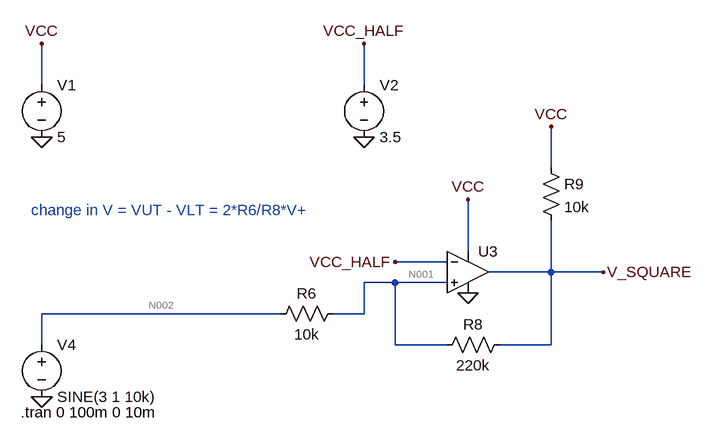
[diagram p0: schematic ovp.asc]
ovp.asc, the LTspice schematic file:
Version 4.1
SHEET 1 4088 1428
WIRE -592 -224 -592 -288
WIRE -96 -224 -96 -288
WIRE 192 -96 192 -160
WIRE 64 32 64 -48
WIRE 32 48 -48 48
WIRE 192 64 192 -16
WIRE 192 64 96 64
WIRE 272 64 192 64
WIRE -48 80 -96 80
WIRE 32 80 -48 80
WIRE -224 128 -592 128
WIRE -96 128 -96 80
WIRE -96 128 -144 128
WIRE -592 176 -592 128
WIRE -48 176 -48 80
WIRE 32 176 -48 176
WIRE 192 176 192 64
WIRE 192 176 112 176
FLAG -592 -144 0
FLAG 272 64 V_SQUARE
FLAG 64 96 0
FLAG 64 -48 VCC
FLAG 192 -160 VCC
FLAG -48 48 VCC_HALF
FLAG -96 -144 0
FLAG -592 -288 VCC
FLAG -96 -288 VCC_HALF
FLAG -592 256 0
SYMBOL voltage -592 -240 R0
WINDOW 123 0 0 Left 0
WINDOW 39 0 0 Left 0
SYMATTR InstName V1
SYMATTR Value 5
SYMBOL OpAmps\\UniversalOpAmp2 64 64 R0
SYMATTR InstName U3
SYMBOL res 128 160 R90
WINDOW 0 0 56 VBottom 2
WINDOW 3 32 56 VTop 2
SYMATTR InstName R8
SYMATTR Value 220k
SYMBOL res 176 -112 R0
SYMATTR InstName R9
SYMATTR Value 10k
SYMBOL res -128 112 R90
WINDOW 0 0 56 VBottom 2
WINDOW 3 32 56 VTop 2
SYMATTR InstName R6
SYMATTR Value 10k
SYMBOL voltage -96 -240 R0
WINDOW 123 0 0 Left 0
WINDOW 39 0 0 Left 0
SYMATTR InstName V2
SYMATTR Value 3.5
SYMBOL voltage -592 160 R0
WINDOW 123 0 0 Left 0
WINDOW 39 0 0 Left 0
SYMATTR InstName V4
SYMATTR Value SINE(3 1 10k)
TEXT -624 280 Left 2 !.tran 0 100m 0 10m
TEXT -608 -32 Left 2 ;change in V = VUT - VLT = 2*R6/R8*V+

The netlist it stands for:
* ovp.asc
V1 VCC 0 5
X§U3 N001 VCC_HALF VCC 0 V_SQUARE level2 Avol=1Meg GBW=10Meg Slew=10Meg Ilimit=25m Rail=0 Vos=0 En=0 Enk=0 In=0 Ink=0 Rin=500Meg  ; pins In+ In- V+ V- OUT
R8 V_SQUARE N001 220k
R9 VCC V_SQUARE 10k
R6 N001 N002 10k
V2 VCC_HALF 0 3.5
V4 N002 0 SINE(3 1 10k)
.tran 0 100m 0 10m
* change in V = VUT - VLT = 2*R6/R8*V+
.lib UniversalOpAmp2.lib
.backanno
.end

* Results of the author's LTspice run, read from the files saved beside the schematic
* Operating Point, zero values left out:
*   V(n001) = 2.87 V
*   V(n002) = 3 V
*   V(v_square) = 5.314 mV
*   V(vcc) = 5 V
*   V(vcc_half) = 3.5 V
*   I(R6) = -13.02 µA
*   I(R8) = -13.02 µA
*   I(R9) = 499.5 µA
*   I(V1) = -500.1 µA
*   I(V2) = -2 nA
*   I(V4) = -13.02 µA
*   Ix(u3:1) = 739.6 pA
*   Ix(u3:2) = 2 nA
*   Ix(u3:3) = 608.6 nA
*   Ix(u3:4) = -513 µA
*   Ix(u3:5) = 512.5 µA
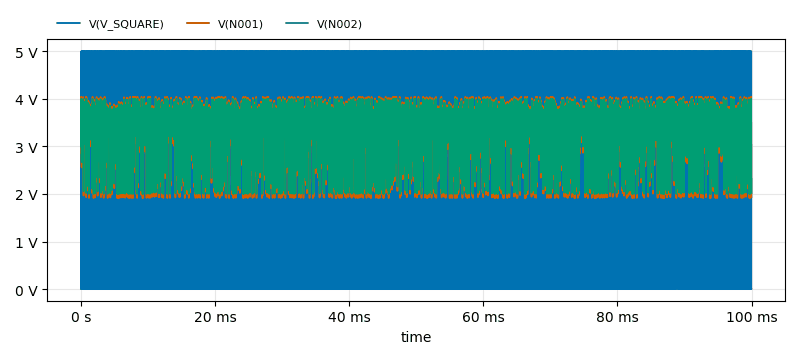
[diagram p1: Transient Analysis of ovp.asc, plotted from the saved traces]
* Transient Analysis, 1 run:
*   V(V_SQUARE): min 5.121 mV, max 5 V, average 1.567 V, rms 2.788 V, last 5.318 mV
*   V(N001): min 1.913 V, max 4.043 V, average 2.941 V, rms 3.038 V, last 2.87 V
*   V(N002): min 2 V, max 4 V, average 3.003 V, rms 3.087 V, last 3 V